# Altium schematic sheet SCH_ESP32_8051_GATE.SchDoc
size A; SheetNumber: 1; SheetTotal: 1
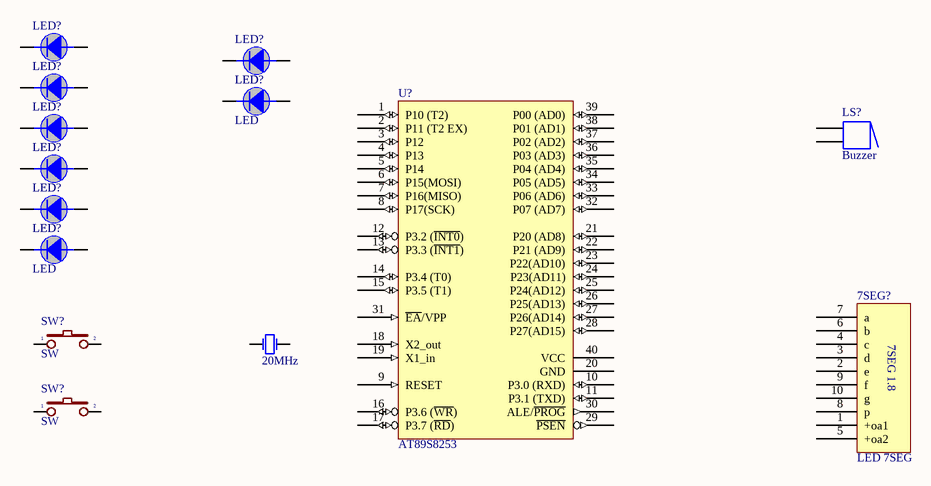
[diagram p0: SCH_ESP32_8051_GATE.SchDoc]

## Parts
(Parts that share a designator on the sheet are numbered #1, #2 ... from top to bottom, then left to right.)
7SEG?  LED 7SEG  [7SEG_37x55]
LED?#1  LED  [LED_phi 5]
LED?#2  LED  [LED_phi 5]
LED?#3  LED  [LED_phi 5]
LED?#4  LED  [LED_phi 5]
LED?#5  LED  [LED_phi 5]
LED?#6  LED  [LED_phi 5]
LED?#7  LED  [LED_phi 5]
LED?#8  LED  [LED_phi 5]
LS?  Buzzer  [ABSM-1574]
SW?#1  SW  [SW-2P-S]
SW?#2  SW  [SW-2P-S]
U?  AT89S8253  [DIP40_]
Y?  20MHz  [XTAL]

## Nets
NetLS?_1: LS?.1 LS?.1A
NetLS?_2: LS?.2 LS?.2A

Not connected (* = marked no-connect by the designer): 7SEG? 1(+oa1) 2(e) 3(d) 4(c) 5(+oa2) 6(b) 7(a) 8(p) 9(f) 10(g); LED?#1 1(anot) 2(Katot); LED?#2 1(anot) 2(Katot); LED?#3 1(anot) 2(Katot); LED?#4 1(anot) 2(Katot); LED?#5 1(anot) 2(Katot); LED?#6 1(anot) 2(Katot); LED?#7 1(anot) 2(Katot); LED?#8 1(anot) 2(Katot); SW?#1 1 2; SW?#2 1 2; U? 1(P10_(T2)) 2(P11_(T2_EX)) 3(P12) 4(P13) 5(P14) 6(P15(MOSI)) 7(P16(MISO)) 8(P17(SCK)) 9(RESET) 10(P3.0_(RXD)) 11(P3.1_(TXD)) 12(P3.2_(~{INT0})) 13(P3.3_(~{INT1})) 14(P3.4_(T0)) 15(P3.5_(T1)) 16(P3.6_(~{WR})) 17(P3.7_(~{RD})) 18(X2_out) 19(X1_in) 20(GND) 21(P20_(AD8)) 22(P21_(AD9)) 23(P22(AD10)) 24(P23(AD11)) 25(P24(AD12)) 26(P25(AD13)) 27(P26(AD14)) 28(P27(AD15)) 29(~{PSEN}) 30(ALE/~{PROG}) 31(~{EA}/VPP) 32(P07_(AD7)) 33(P06_(AD6)) 34(P05_(AD5)) 35(P04_(AD4)) 36(P03_(AD3)) 37(P02_(AD2)) 38(P01_(AD1)) 39(P00_(AD0)) 40(VCC); Y? 1(OSC1) 2(OSC2)

## Notes on the sheet
- (in symbol LED 7SEG) 7SEG 1.8

## Library data of the parts
7SEG? = LED 7SEG: LED 7 THANH
LED?#1-LED?#8 = LED_phi 5
LS? = Buzzer: Magnetic Transducer Buzzer; Published: 24-Mar-1999; LatestRevisionDate: 17-Dec-2003; LatestRevisionNote: Schematic revised, PCB Footprint replaced.; DatasheetVersion: 17-Dec-2003; PackageReference: ABSM-1574; Publisher: Altium Limited; PackageDescription: Magnetic Transducer Buzzer; ComponentLink1Description: Manufacturer Link; ComponentLink1URL: http://www.megastar.com/linecard/buzzmode/index.php
SW?#1 SW?#2 = SW2: Switch button 2 pin; Value: SW chip 2 pin
Y? = XTAL_1: Crystal Oscillator; Published: 8-Jun-2000; LatestRevisionDate: 17-Jul-2002; LatestRevisionNote: Re-released for DXP Platform.; PackageReference: R38; Publisher: Altium Limited